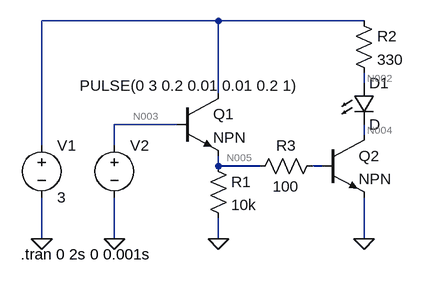
[diagram p0: schematic schemat2.asc]
schemat2.asc, the LTspice schematic file:
Version 4
SHEET 1 880 680
WIRE -64 128 -336 128
WIRE 160 128 -64 128
WIRE 160 224 160 208
WIRE -64 240 -64 128
WIRE -128 288 -224 288
WIRE 160 304 160 288
WIRE -336 320 -336 128
WIRE -224 320 -224 288
WIRE -64 352 -64 336
WIRE 0 352 -64 352
WIRE 96 352 80 352
WIRE -336 464 -336 400
WIRE -224 464 -224 400
WIRE -64 464 -64 432
WIRE 160 464 160 400
FLAG -336 464 0
FLAG -64 464 0
FLAG 160 464 0
FLAG -224 464 0
SYMBOL voltage -336 304 R0
WINDOW 123 0 0 Left 0
WINDOW 39 0 0 Left 0
SYMATTR InstName V1
SYMATTR Value 3
SYMBOL npn -128 240 R0
SYMATTR InstName Q1
SYMBOL npn 96 304 R0
SYMATTR InstName Q2
SYMBOL res -80 336 R0
SYMATTR InstName R1
SYMATTR Value 10k
SYMBOL res 144 112 R0
SYMATTR InstName R2
SYMATTR Value 330
SYMBOL LED 144 224 R0
SYMATTR InstName D1
SYMBOL voltage -224 304 R0
WINDOW 3 -53 -76 Left 2
WINDOW 123 0 0 Left 0
WINDOW 39 0 0 Left 0
SYMATTR InstName V2
SYMATTR Value PULSE(0 3 0.2 0.01 0.01 0.2 1)
SYMBOL res 96 336 R90
WINDOW 0 0 56 VBottom 2
WINDOW 3 32 56 VTop 2
SYMATTR InstName R3
SYMATTR Value 100
TEXT -368 488 Left 2 !.tran 0 2s 0 0.001s

The netlist it stands for:
* schemat2.asc
V1 N001 0 3
Q1 N001 N003 N005 0 NPN
Q2 N004 N006 0 0 NPN
R1 N005 0 10k
R2 N001 N002 330
D1 N002 N004 D
V2 N003 0 PULSE(0 3 0.2 0.01 0.01 0.2 1)
R3 N006 N005 100
.model D D
.lib standard.dio
.model NPN NPN
.model PNP PNP
.lib standard.bjt
.tran 0 2s 0 0.001s
.backanno
.end

* Results of the author's LTspice run, read from the files saved beside the schematic
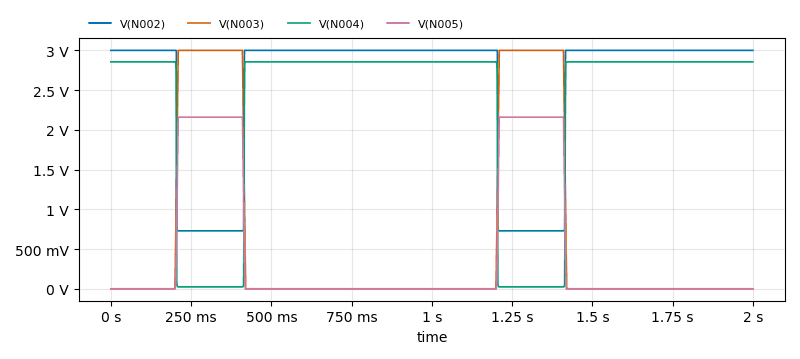
[diagram p1: Transient Analysis of schemat2.asc, plotted from the saved traces]
* Transient Analysis, 1 run:
*   V(N002): min 729.2 mV, max 3 V, average 2.523 V, rms 2.687 V, last 3 V
*   V(N003): min 0 V, max 3 V, average 630 mV, rms 1.364 V, last 0 V
*   V(N004): min 24.16 mV, max 2.855 V, average 2.259 V, rms 2.536 V, last 2.855 V
*   V(N005): min 0 V, max 2.159 V, average 448.6 mV, rms 977.9 mV, last 0 V